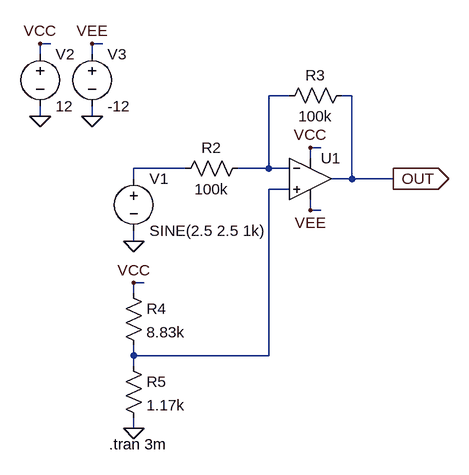
[diagram p0: schematic V2164_Input_Amp_LED.asc]
V2164_Input_Amp_LED.asc, the LTspice schematic file:
Version 4
SHEET 1 880 764
WIRE -160 -48 -176 -48
WIRE -80 -48 -96 -48
WIRE -176 -32 -176 -48
WIRE -96 -32 -96 -48
WIRE 208 32 176 32
WIRE 304 32 288 32
WIRE -176 64 -176 48
WIRE -96 64 -96 48
WIRE 256 112 240 112
WIRE 240 128 240 112
WIRE 48 144 -32 144
WIRE 176 144 176 32
WIRE 176 144 128 144
WIRE 208 144 176 144
WIRE -32 160 -32 144
WIRE 304 160 304 32
WIRE 304 160 272 160
WIRE 368 160 304 160
WIRE 208 176 176 176
WIRE 240 208 240 192
WIRE 256 208 240 208
WIRE -32 256 -32 240
WIRE -16 320 -32 320
WIRE -32 336 -32 320
WIRE -32 432 -32 416
WIRE 176 432 176 176
WIRE 176 432 -32 432
WIRE -32 448 -32 432
WIRE -32 544 -32 528
FLAG 240 112 VCC
FLAG 240 208 VEE
FLAG -32 256 0
FLAG -32 320 VCC
FLAG -32 544 0
FLAG 368 160 OUT
IOPIN 368 160 Out
FLAG -176 64 0
FLAG -96 64 0
FLAG -176 -48 VCC
FLAG -96 -48 VEE
SYMBOL Opamps\\UniversalOpamp2 240 160 R0
SYMATTR InstName U1
SYMBOL res 144 128 R90
WINDOW 0 0 56 VBottom 2
WINDOW 3 32 56 VTop 2
SYMATTR InstName R2
SYMATTR Value 100k
SYMBOL res 304 16 R90
WINDOW 0 0 56 VBottom 2
WINDOW 3 32 56 VTop 2
SYMATTR InstName R3
SYMATTR Value 100k
SYMBOL voltage -32 144 R0
WINDOW 123 0 0 Left 0
WINDOW 39 0 0 Left 0
SYMATTR InstName V1
SYMATTR Value SINE(2.5 2.5 1k)
SYMBOL res -48 320 R0
SYMATTR InstName R4
SYMATTR Value 8.83k
SYMBOL res -48 432 R0
SYMATTR InstName R5
SYMATTR Value 1.17k
SYMBOL voltage -176 -48 R0
WINDOW 123 0 0 Left 0
WINDOW 39 0 0 Left 0
SYMATTR InstName V2
SYMATTR Value 12
SYMBOL voltage -96 -48 R0
WINDOW 123 0 0 Left 0
WINDOW 39 0 0 Left 0
SYMATTR InstName V3
SYMATTR Value -12
TEXT -70 568 Left 2 !.tran 3m

The netlist it stands for:
* V2164_Input_Amp_LED.asc
XU1 N003 N001 VCC VEE OUT level.2 Avol=1Meg GBW=10Meg Slew=10Meg ilimit=25m rail=0 Vos=0 phimargin=45 en=0 enk=0 in=0 ink=0 Rin=500Meg  ; pins IN+ IN- V+ V- OUT
R2 N001 N002 100k
R3 OUT N001 100k
V1 N002 0 SINE(2.5 2.5 1k)
R4 VCC N003 8.83k
R5 N003 0 1.17k
V2 VCC 0 12
V3 VEE 0 -12
.tran 3m
.lib UniversalOpamps2.sub
.backanno
.end